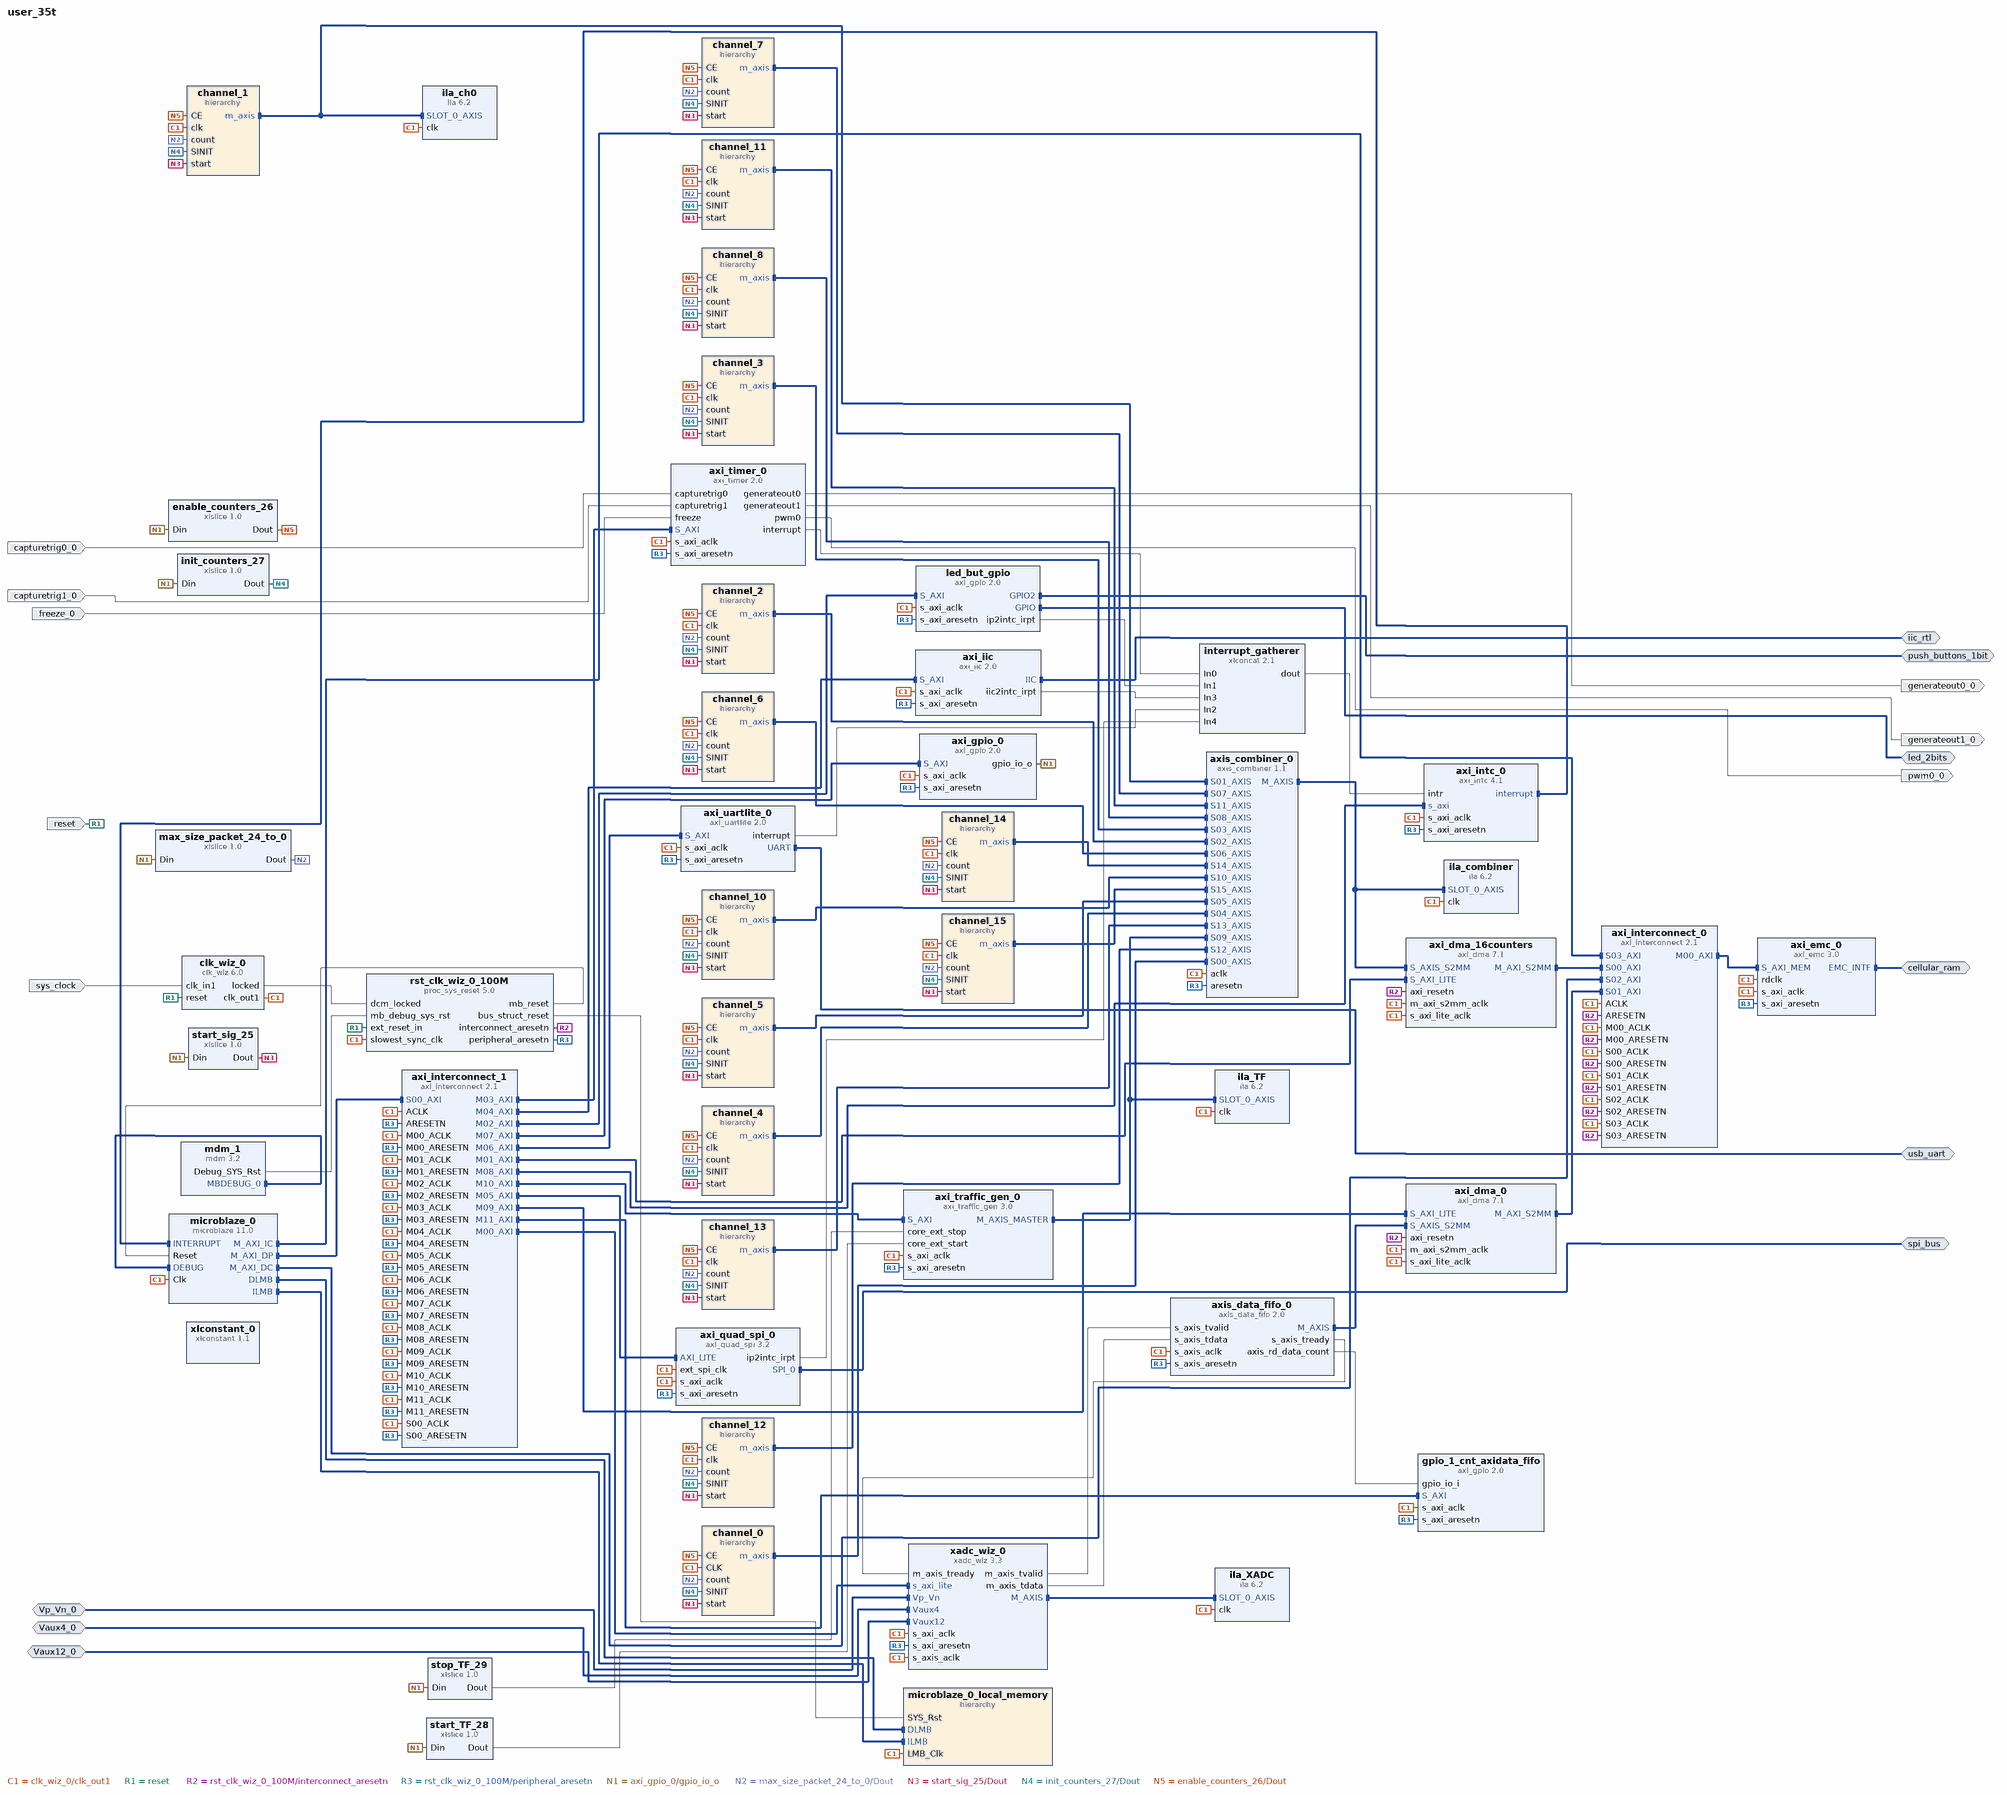
[diagram p0: block diagram of the top level]
# Vivado block design user_35t, xc7a35tcpg236-1, Vivado 2020.2
create_bd_design user_35t

create_bd_intf_port -mode Master -vlnv xilinx.com:interface:emc_rtl:1.0 cellular_ram
create_bd_intf_port -mode Master -vlnv xilinx.com:interface:gpio_rtl:1.0 led_2bits
create_bd_intf_port -mode Master -vlnv xilinx.com:interface:gpio_rtl:1.0 push_buttons_1bit
create_bd_intf_port -mode Master -vlnv xilinx.com:interface:uart_rtl:1.0 usb_uart
create_bd_intf_port -mode Master -vlnv xilinx.com:interface:iic_rtl:1.0 iic_rtl
create_bd_intf_port -mode Master -vlnv xilinx.com:interface:spi_rtl:1.0 spi_bus
create_bd_intf_port -mode Slave -vlnv xilinx.com:interface:diff_analog_io_rtl:1.0 Vp_Vn_0
create_bd_intf_port -mode Slave -vlnv xilinx.com:interface:diff_analog_io_rtl:1.0 Vaux4_0
create_bd_intf_port -mode Slave -vlnv xilinx.com:interface:diff_analog_io_rtl:1.0 Vaux12_0
create_bd_port -dir I -type rst reset
set_property -dict {CONFIG.POLARITY ACTIVE_HIGH} [get_bd_ports reset]
create_bd_port -dir I -type clk sys_clock
set_property -dict {CONFIG.FREQ_HZ 12000000 CONFIG.PHASE 0.000} [get_bd_ports sys_clock]
create_bd_port -dir O generateout0_0
create_bd_port -dir I capturetrig0_0
create_bd_port -dir I capturetrig1_0
create_bd_port -dir I freeze_0
create_bd_port -dir O generateout1_0
create_bd_port -dir O pwm0_0

create_bd_cell -type hier microblaze_0_local_memory
create_bd_cell -type ip -vlnv xilinx.com:ip:axi_emc:3.0 axi_emc_0
set_property -dict [list \
  CONFIG.C_MEM0_TYPE 1 \
  CONFIG.C_MEM0_WIDTH 8 \
  CONFIG.C_TAVDV_PS_MEM_0 8000 \
  CONFIG.C_TCEDV_PS_MEM_0 8000 \
  CONFIG.C_THZCE_PS_MEM_0 8000 \
  CONFIG.C_THZOE_PS_MEM_0 8000 \
  CONFIG.C_TLZWE_PS_MEM_0 3000 \
  CONFIG.C_TWC_PS_MEM_0 8000 \
  CONFIG.C_TWP_PS_MEM_0 8000 \
  CONFIG.EMC_BOARD_INTERFACE cellular_ram \
  CONFIG.USE_BOARD_FLOW true \
] [get_bd_cells axi_emc_0]
create_bd_cell -type ip -vlnv xilinx.com:ip:axi_gpio:2.0 led_but_gpio
set_property -dict [list \
  CONFIG.C_INTERRUPT_PRESENT 1 \
  CONFIG.GPIO2_BOARD_INTERFACE push_buttons_1bit \
  CONFIG.GPIO_BOARD_INTERFACE led_2bits \
  CONFIG.USE_BOARD_FLOW true \
] [get_bd_cells led_but_gpio]
create_bd_cell -type ip -vlnv xilinx.com:ip:axi_intc:4.1 axi_intc_0
set_property -dict [list \
  CONFIG.C_DISABLE_SYNCHRONIZERS 1 \
  CONFIG.C_HAS_FAST 0 \
  CONFIG.C_HAS_ILR 1 \
  CONFIG.C_MB_CLK_NOT_CONNECTED 1 \
] [get_bd_cells axi_intc_0]
create_bd_cell -type ip -vlnv xilinx.com:ip:axi_timer:2.0 axi_timer_0
create_bd_cell -type ip -vlnv xilinx.com:ip:axi_uartlite:2.0 axi_uartlite_0
set_property -dict {CONFIG.UARTLITE_BOARD_INTERFACE usb_uart CONFIG.USE_BOARD_FLOW true} [get_bd_cells axi_uartlite_0]
create_bd_cell -type ip -vlnv xilinx.com:ip:clk_wiz:6.0 clk_wiz_0
set_property -dict [list \
  CONFIG.CLKIN1_JITTER_PS 833.33 \
  CONFIG.CLKOUT1_JITTER 479.872 \
  CONFIG.CLKOUT1_PHASE_ERROR 668.310 \
  CONFIG.CLK_IN1_BOARD_INTERFACE sys_clock \
  CONFIG.MMCM_CLKFBOUT_MULT_F 62.500 \
  CONFIG.MMCM_CLKIN1_PERIOD 83.333 \
  CONFIG.MMCM_CLKIN2_PERIOD 10.0 \
  CONFIG.MMCM_CLKOUT0_DIVIDE_F 7.500 \
  CONFIG.RESET_BOARD_INTERFACE reset \
  CONFIG.USE_BOARD_FLOW true \
] [get_bd_cells clk_wiz_0]
create_bd_cell -type ip -vlnv xilinx.com:ip:mdm:3.2 mdm_1
create_bd_cell -type ip -vlnv xilinx.com:ip:microblaze:11.0 microblaze_0
set_property -dict [list \
  CONFIG.C_ADDR_TAG_BITS 8 \
  CONFIG.C_CACHE_BYTE_SIZE 2048 \
  CONFIG.C_DCACHE_ADDR_TAG 8 \
  CONFIG.C_DCACHE_BYTE_SIZE 2048 \
  CONFIG.C_DCACHE_USE_WRITEBACK 1 \
  CONFIG.C_DEBUG_ENABLED 1 \
  CONFIG.C_DIV_ZERO_EXCEPTION 1 \
  CONFIG.C_D_AXI 1 \
  CONFIG.C_D_LMB 1 \
  CONFIG.C_ICACHE_LINE_LEN 4 \
  CONFIG.C_ILL_OPCODE_EXCEPTION 1 \
  CONFIG.C_I_LMB 1 \
  CONFIG.C_M_AXI_D_BUS_EXCEPTION 1 \
  CONFIG.C_M_AXI_I_BUS_EXCEPTION 1 \
  CONFIG.C_NUMBER_OF_PC_BRK 2 \
  CONFIG.C_OPCODE_0x0_ILLEGAL 1 \
  CONFIG.C_UNALIGNED_EXCEPTIONS 1 \
  CONFIG.C_USE_BARREL 1 \
  CONFIG.C_USE_DCACHE 1 \
  CONFIG.C_USE_DIV 1 \
  CONFIG.C_USE_HW_MUL 1 \
  CONFIG.C_USE_ICACHE 1 \
  CONFIG.C_USE_MSR_INSTR 1 \
  CONFIG.C_USE_PCMP_INSTR 1 \
  CONFIG.C_USE_STACK_PROTECTION 1 \
  CONFIG.G_TEMPLATE_LIST 9 \
  CONFIG.G_USE_EXCEPTIONS 1 \
] [get_bd_cells microblaze_0]
create_bd_cell -type ip -vlnv xilinx.com:ip:proc_sys_reset:5.0 rst_clk_wiz_0_100M
set_property -dict {CONFIG.RESET_BOARD_INTERFACE reset CONFIG.USE_BOARD_FLOW true} [get_bd_cells rst_clk_wiz_0_100M]
create_bd_cell -type ip -vlnv xilinx.com:ip:xlconcat:2.1 interrupt_gatherer
set_property -dict {CONFIG.NUM_PORTS 5} [get_bd_cells interrupt_gatherer]
create_bd_cell -type ip -vlnv xilinx.com:ip:axi_iic:2.0 axi_iic
set_property -dict {CONFIG.IIC_FREQ_KHZ 400} [get_bd_cells axi_iic]
create_bd_cell -type ip -vlnv xilinx.com:ip:axi_quad_spi:3.2 axi_quad_spi_0
set_property -dict [list \
  CONFIG.C_FIFO_DEPTH 256 \
  CONFIG.C_SCK_RATIO 16 \
  CONFIG.C_SPI_MEMORY 1 \
  CONFIG.C_SPI_MODE 0 \
  CONFIG.QSPI_BOARD_INTERFACE Custom \
  CONFIG.USE_BOARD_FLOW true \
] [get_bd_cells axi_quad_spi_0]
create_bd_cell -type ip -vlnv xilinx.com:ip:xadc_wiz:3.3 xadc_wiz_0
set_property -dict [list \
  CONFIG.AVERAGE_ENABLE_TEMPERATURE false \
  CONFIG.AVERAGE_ENABLE_VAUXP0_VAUXN0 false \
  CONFIG.CHANNEL_ENABLE_TEMPERATURE true \
  CONFIG.CHANNEL_ENABLE_VAUXP0_VAUXN0 false \
  CONFIG.CHANNEL_ENABLE_VAUXP12_VAUXN12 true \
  CONFIG.CHANNEL_ENABLE_VAUXP4_VAUXN4 true \
  CONFIG.CHANNEL_ENABLE_VP_VN false \
  CONFIG.ENABLE_AXI4STREAM true \
  CONFIG.ENABLE_EXTERNAL_MUX false \
  CONFIG.EXTERNAL_MUXADDR_ENABLE true \
  CONFIG.EXTERNAL_MUX_CHANNEL VP_VN \
  CONFIG.OT_ALARM false \
  CONFIG.SEQUENCER_MODE Continuous \
  CONFIG.SINGLE_CHANNEL_SELECTION TEMPERATURE \
  CONFIG.VCCINT_ALARM false \
  CONFIG.XADC_STARUP_SELECTION channel_sequencer \
] [get_bd_cells xadc_wiz_0]
create_bd_cell -type ip -vlnv xilinx.com:ip:axi_dma:7.1 axi_dma_0
set_property -dict {CONFIG.c_include_mm2s 0 CONFIG.c_include_sg 0 CONFIG.c_micro_dma 0} [get_bd_cells axi_dma_0]
create_bd_cell -type ip -vlnv xilinx.com:ip:axi_gpio:2.0 axi_gpio_0
set_property -dict {CONFIG.C_ALL_OUTPUTS 1 CONFIG.C_GPIO_WIDTH 32} [get_bd_cells axi_gpio_0]
create_bd_cell -type ip -vlnv xilinx.com:ip:xlslice:1.0 max_size_packet_24_to_0
set_property -dict [list \
  CONFIG.DIN_FROM 24 \
  CONFIG.DIN_TO 0 \
  CONFIG.DIN_WIDTH 32 \
  CONFIG.DOUT_WIDTH 25 \
] [get_bd_cells max_size_packet_24_to_0]
create_bd_cell -type ip -vlnv xilinx.com:ip:xlslice:1.0 start_sig_25
set_property -dict {CONFIG.DIN_FROM 25 CONFIG.DIN_TO 25 CONFIG.DIN_WIDTH 32 CONFIG.DOUT_WIDTH 1} [get_bd_cells start_sig_25]
create_bd_cell -type ip -vlnv xilinx.com:ip:xlconstant:1.1 xlconstant_0
create_bd_cell -type ip -vlnv xilinx.com:ip:xlslice:1.0 init_counters_27
set_property -dict {CONFIG.DIN_FROM 27 CONFIG.DIN_TO 27 CONFIG.DIN_WIDTH 32 CONFIG.DOUT_WIDTH 1} [get_bd_cells init_counters_27]
create_bd_cell -type ip -vlnv xilinx.com:ip:axis_combiner:1.1 axis_combiner_0
set_property -dict {CONFIG.NUM_SI 16} [get_bd_cells axis_combiner_0]
create_bd_cell -type hier channel_0
create_bd_cell -type hier channel_1
create_bd_cell -type hier channel_2
create_bd_cell -type hier channel_3
create_bd_cell -type hier channel_5
create_bd_cell -type hier channel_6
create_bd_cell -type hier channel_7
create_bd_cell -type hier channel_8
create_bd_cell -type hier channel_10
create_bd_cell -type hier channel_11
create_bd_cell -type hier channel_12
create_bd_cell -type hier channel_13
create_bd_cell -type hier channel_14
create_bd_cell -type hier channel_15
create_bd_cell -type hier channel_4
create_bd_cell -type ip -vlnv xilinx.com:ip:axi_dma:7.1 axi_dma_16counters
set_property -dict {CONFIG.c_include_mm2s 0 CONFIG.c_include_sg 0 CONFIG.c_micro_dma 0} [get_bd_cells axi_dma_16counters]
create_bd_cell -type ip -vlnv xilinx.com:ip:ila:6.2 ila_combiner
set_property -dict {CONFIG.C_NUM_OF_PROBES 9 CONFIG.C_SLOT_0_AXI_PROTOCOL AXI4S} [get_bd_cells ila_combiner]
create_bd_cell -type ip -vlnv xilinx.com:ip:ila:6.2 ila_ch0
set_property -dict {CONFIG.C_NUM_OF_PROBES 9 CONFIG.C_SLOT_0_AXI_PROTOCOL AXI4S} [get_bd_cells ila_ch0]
create_bd_cell -type ip -vlnv xilinx.com:ip:xlslice:1.0 enable_counters_26
set_property -dict {CONFIG.DIN_FROM 26 CONFIG.DIN_TO 26 CONFIG.DIN_WIDTH 32 CONFIG.DOUT_WIDTH 1} [get_bd_cells enable_counters_26]
create_bd_cell -type ip -vlnv xilinx.com:ip:axi_interconnect:2.1 axi_interconnect_0
set_property -dict {CONFIG.NUM_MI 1 CONFIG.NUM_SI 4} [get_bd_cells axi_interconnect_0]
create_bd_cell -type ip -vlnv xilinx.com:ip:axi_interconnect:2.1 axi_interconnect_1
set_property -dict {CONFIG.NUM_MI 12} [get_bd_cells axi_interconnect_1]
create_bd_cell -type ip -vlnv xilinx.com:ip:axi_traffic_gen:3.0 axi_traffic_gen_0
set_property -dict [list \
  CONFIG.ATG_OPTIONS Custom \
  CONFIG.C_ATG_MODE AXI4-Stream \
  CONFIG.C_AXIS_MODE {Master Only} \
  CONFIG.C_AXIS_SPARSE_EN true \
  CONFIG.C_AXIS_TDATA_WIDTH 16 \
] [get_bd_cells axi_traffic_gen_0]
create_bd_cell -type ip -vlnv xilinx.com:ip:xlslice:1.0 start_TF_28
set_property -dict {CONFIG.DIN_FROM 28 CONFIG.DIN_TO 28 CONFIG.DIN_WIDTH 32 CONFIG.DOUT_WIDTH 1} [get_bd_cells start_TF_28]
create_bd_cell -type ip -vlnv xilinx.com:ip:xlslice:1.0 stop_TF_29
set_property -dict {CONFIG.DIN_FROM 29 CONFIG.DIN_TO 29 CONFIG.DIN_WIDTH 32 CONFIG.DOUT_WIDTH 1} [get_bd_cells stop_TF_29]
create_bd_cell -type ip -vlnv xilinx.com:ip:ila:6.2 ila_TF
set_property -dict {CONFIG.C_NUM_OF_PROBES 9 CONFIG.C_SLOT_0_AXI_PROTOCOL AXI4S} [get_bd_cells ila_TF]
create_bd_cell -type ip -vlnv xilinx.com:ip:ila:6.2 ila_XADC
set_property -dict {CONFIG.C_NUM_OF_PROBES 9 CONFIG.C_SLOT_0_AXI_PROTOCOL AXI4S} [get_bd_cells ila_XADC]
create_bd_cell -type ip -vlnv xilinx.com:ip:axis_data_fifo:2.0 axis_data_fifo_0
set_property -dict [list \
  CONFIG.FIFO_DEPTH 4096 \
  CONFIG.HAS_RD_DATA_COUNT 1 \
  CONFIG.HAS_TLAST 1 \
  CONFIG.TDATA_NUM_BYTES 2 \
] [get_bd_cells axis_data_fifo_0]
create_bd_cell -type ip -vlnv xilinx.com:ip:axi_gpio:2.0 gpio_1_cnt_axidata_fifo
set_property -dict {CONFIG.C_ALL_INPUTS 1} [get_bd_cells gpio_1_cnt_axidata_fifo]

# ---- hierarchy /microblaze_0_local_memory ----
current_bd_instance /microblaze_0_local_memory
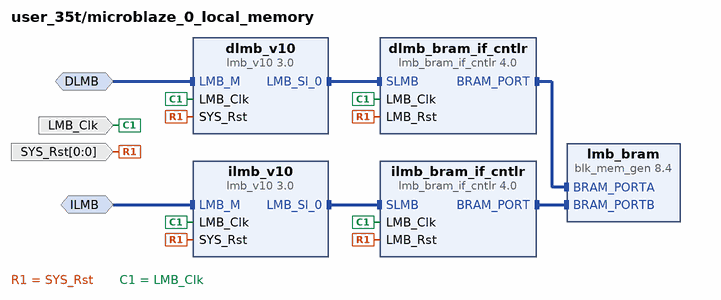
[diagram p1: block diagram inside /microblaze_0_local_memory]
create_bd_intf_pin -mode MirroredMaster -vlnv xilinx.com:interface:lmb_rtl:1.0 DLMB
create_bd_intf_pin -mode MirroredMaster -vlnv xilinx.com:interface:lmb_rtl:1.0 ILMB
create_bd_pin -dir I -type clk LMB_Clk
create_bd_pin -dir I -from 0 -to 0 -type rst SYS_Rst

create_bd_cell -type ip -vlnv xilinx.com:ip:lmb_bram_if_cntlr:4.0 dlmb_bram_if_cntlr
set_property -dict {CONFIG.C_ECC 0} [get_bd_cells dlmb_bram_if_cntlr]
create_bd_cell -type ip -vlnv xilinx.com:ip:lmb_v10:3.0 dlmb_v10
create_bd_cell -type ip -vlnv xilinx.com:ip:lmb_bram_if_cntlr:4.0 ilmb_bram_if_cntlr
set_property -dict {CONFIG.C_ECC 0} [get_bd_cells ilmb_bram_if_cntlr]
create_bd_cell -type ip -vlnv xilinx.com:ip:lmb_v10:3.0 ilmb_v10
create_bd_cell -type ip -vlnv xilinx.com:ip:blk_mem_gen:8.4 lmb_bram
set_property -dict [list \
  CONFIG.EN_SAFETY_CKT false \
  CONFIG.Enable_B Use_ENB_Pin \
  CONFIG.Memory_Type True_Dual_Port_RAM \
  CONFIG.Port_B_Clock 100 \
  CONFIG.Port_B_Enable_Rate 100 \
  CONFIG.Port_B_Write_Rate 50 \
  CONFIG.Use_RSTB_Pin true \
  CONFIG.use_bram_block BRAM_Controller \
] [get_bd_cells lmb_bram]

# ---- hierarchy /channel_0 ----
current_bd_instance /channel_0
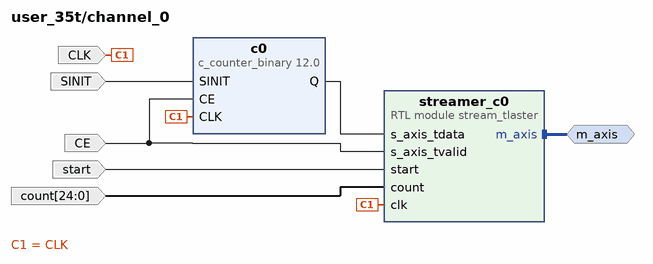
[diagram p2: block diagram inside /channel_0]
create_bd_intf_pin -mode Master -vlnv xilinx.com:interface:axis_rtl:1.0 m_axis
create_bd_pin -dir I start
create_bd_pin -dir I -from 24 -to 0 count
create_bd_pin -dir I -type data SINIT
create_bd_pin -dir I -type clk CLK
create_bd_pin -dir I CE

create_bd_cell -type ip -vlnv xilinx.com:ip:c_counter_binary:12.0 c0
set_property -dict [list \
  CONFIG.CE true \
  CONFIG.Load false \
  CONFIG.Output_Width 16 \
  CONFIG.SCLR false \
  CONFIG.SINIT true \
  CONFIG.SINIT_Value 0 \
  CONFIG.Sync_Threshold_Output false \
] [get_bd_cells c0]
create_bd_cell -type module -reference stream_tlaster streamer_c0

# ---- hierarchy /channel_1 ----
current_bd_instance /channel_1
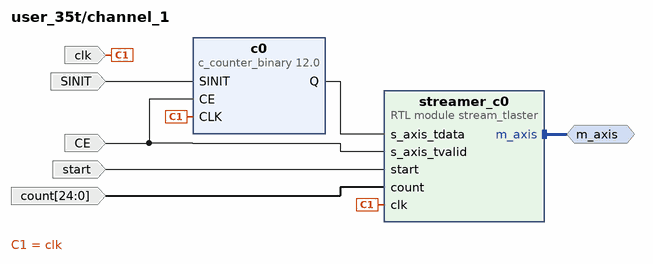
[diagram p3: block diagram inside /channel_1]
create_bd_intf_pin -mode Master -vlnv xilinx.com:interface:axis_rtl:1.0 m_axis
create_bd_pin -dir I start
create_bd_pin -dir I -from 24 -to 0 count
create_bd_pin -dir I -type data SINIT
create_bd_pin -dir I clk
create_bd_pin -dir I CE

create_bd_cell -type ip -vlnv xilinx.com:ip:c_counter_binary:12.0 c0
set_property -dict [list \
  CONFIG.CE true \
  CONFIG.Load false \
  CONFIG.Output_Width 16 \
  CONFIG.SCLR false \
  CONFIG.SINIT true \
  CONFIG.SINIT_Value 1000 \
  CONFIG.SSET false \
  CONFIG.Sync_Threshold_Output false \
] [get_bd_cells c0]
create_bd_cell -type module -reference stream_tlaster streamer_c0

# ---- hierarchy /channel_2 ----
current_bd_instance /channel_2
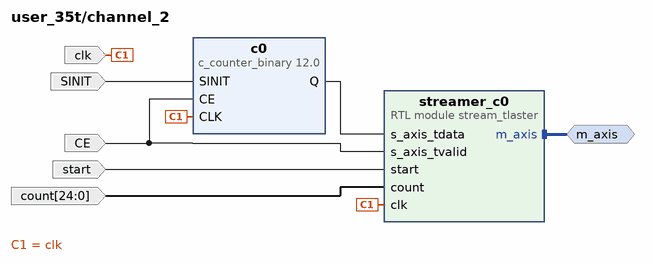
[diagram p4: block diagram inside /channel_2]
create_bd_intf_pin -mode Master -vlnv xilinx.com:interface:axis_rtl:1.0 m_axis
create_bd_pin -dir I start
create_bd_pin -dir I -from 24 -to 0 count
create_bd_pin -dir I -type data SINIT
create_bd_pin -dir I clk
create_bd_pin -dir I -type ce CE

create_bd_cell -type ip -vlnv xilinx.com:ip:c_counter_binary:12.0 c0
set_property -dict [list \
  CONFIG.CE true \
  CONFIG.Load false \
  CONFIG.Output_Width 16 \
  CONFIG.SCLR false \
  CONFIG.SINIT true \
  CONFIG.SINIT_Value 2000 \
  CONFIG.Sync_Threshold_Output false \
] [get_bd_cells c0]
create_bd_cell -type module -reference stream_tlaster streamer_c0

# ---- hierarchy /channel_3 ----
current_bd_instance /channel_3
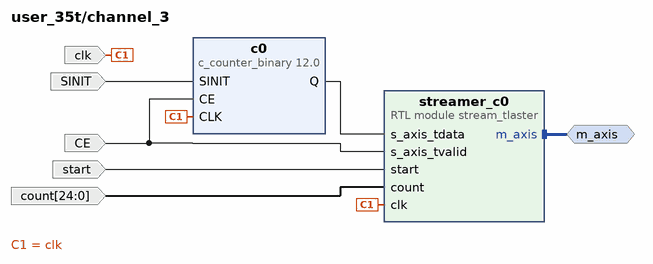
[diagram p5: block diagram inside /channel_3]
create_bd_intf_pin -mode Master -vlnv xilinx.com:interface:axis_rtl:1.0 m_axis
create_bd_pin -dir I start
create_bd_pin -dir I -from 24 -to 0 count
create_bd_pin -dir I -type data SINIT
create_bd_pin -dir I clk
create_bd_pin -dir I CE

create_bd_cell -type ip -vlnv xilinx.com:ip:c_counter_binary:12.0 c0
set_property -dict [list \
  CONFIG.CE true \
  CONFIG.Load false \
  CONFIG.Output_Width 16 \
  CONFIG.SCLR false \
  CONFIG.SINIT true \
  CONFIG.SINIT_Value 3000 \
  CONFIG.Sync_Threshold_Output false \
] [get_bd_cells c0]
create_bd_cell -type module -reference stream_tlaster streamer_c0

# ---- hierarchy /channel_5 ----
current_bd_instance /channel_5
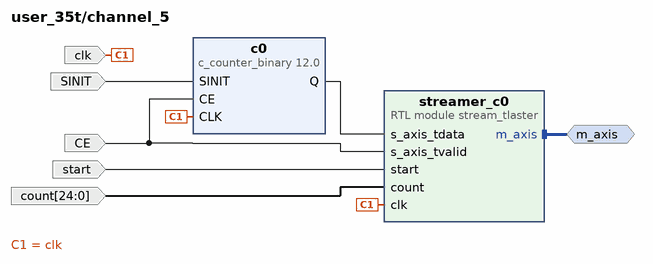
[diagram p6: block diagram inside /channel_5]
create_bd_intf_pin -mode Master -vlnv xilinx.com:interface:axis_rtl:1.0 m_axis
create_bd_pin -dir I start
create_bd_pin -dir I -from 24 -to 0 count
create_bd_pin -dir I -type data SINIT
create_bd_pin -dir I clk
create_bd_pin -dir I CE

create_bd_cell -type ip -vlnv xilinx.com:ip:c_counter_binary:12.0 c0
set_property -dict [list \
  CONFIG.CE true \
  CONFIG.Load false \
  CONFIG.Output_Width 16 \
  CONFIG.SCLR false \
  CONFIG.SINIT true \
  CONFIG.SINIT_Value 5000 \
  CONFIG.Sync_Threshold_Output false \
] [get_bd_cells c0]
create_bd_cell -type module -reference stream_tlaster streamer_c0

# ---- hierarchy /channel_6 ----
current_bd_instance /channel_6
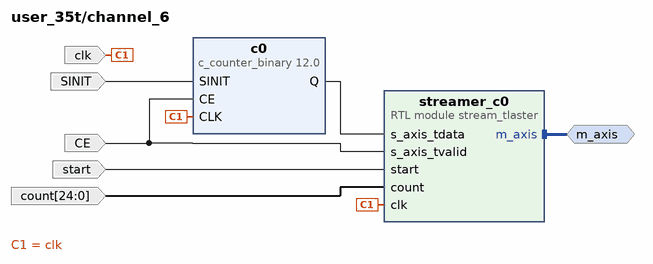
[diagram p7: block diagram inside /channel_6]
create_bd_intf_pin -mode Master -vlnv xilinx.com:interface:axis_rtl:1.0 m_axis
create_bd_pin -dir I start
create_bd_pin -dir I -from 24 -to 0 count
create_bd_pin -dir I -type data SINIT
create_bd_pin -dir I clk
create_bd_pin -dir I CE

create_bd_cell -type ip -vlnv xilinx.com:ip:c_counter_binary:12.0 c0
set_property -dict [list \
  CONFIG.CE true \
  CONFIG.Load false \
  CONFIG.Output_Width 16 \
  CONFIG.SCLR false \
  CONFIG.SINIT true \
  CONFIG.SINIT_Value 6000 \
  CONFIG.Sync_Threshold_Output false \
] [get_bd_cells c0]
create_bd_cell -type module -reference stream_tlaster streamer_c0

# ---- hierarchy /channel_7 ----
current_bd_instance /channel_7
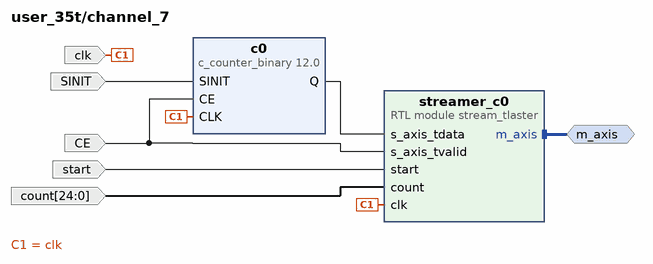
[diagram p8: block diagram inside /channel_7]
create_bd_intf_pin -mode Master -vlnv xilinx.com:interface:axis_rtl:1.0 m_axis
create_bd_pin -dir I start
create_bd_pin -dir I -from 24 -to 0 count
create_bd_pin -dir I -type data SINIT
create_bd_pin -dir I clk
create_bd_pin -dir I CE

create_bd_cell -type ip -vlnv xilinx.com:ip:c_counter_binary:12.0 c0
set_property -dict [list \
  CONFIG.CE true \
  CONFIG.Load false \
  CONFIG.Output_Width 16 \
  CONFIG.SCLR false \
  CONFIG.SINIT true \
  CONFIG.SINIT_Value 7000 \
  CONFIG.Sync_Threshold_Output false \
] [get_bd_cells c0]
create_bd_cell -type module -reference stream_tlaster streamer_c0

# ---- hierarchy /channel_8 ----
current_bd_instance /channel_8
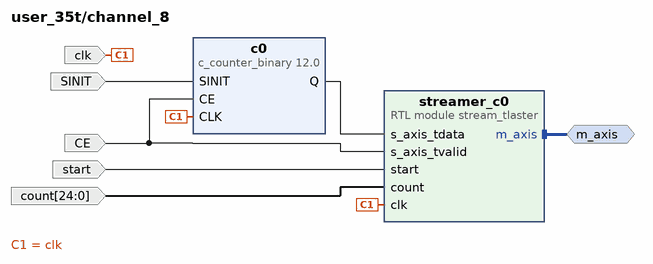
[diagram p9: block diagram inside /channel_8]
create_bd_intf_pin -mode Master -vlnv xilinx.com:interface:axis_rtl:1.0 m_axis
create_bd_pin -dir I start
create_bd_pin -dir I -from 24 -to 0 count
create_bd_pin -dir I -type data SINIT
create_bd_pin -dir I clk
create_bd_pin -dir I CE

create_bd_cell -type ip -vlnv xilinx.com:ip:c_counter_binary:12.0 c0
set_property -dict [list \
  CONFIG.CE true \
  CONFIG.Load false \
  CONFIG.Output_Width 16 \
  CONFIG.SCLR false \
  CONFIG.SINIT true \
  CONFIG.SINIT_Value 8000 \
  CONFIG.Sync_Threshold_Output false \
] [get_bd_cells c0]
create_bd_cell -type module -reference stream_tlaster streamer_c0

# ---- hierarchy /channel_10 ----
current_bd_instance /channel_10
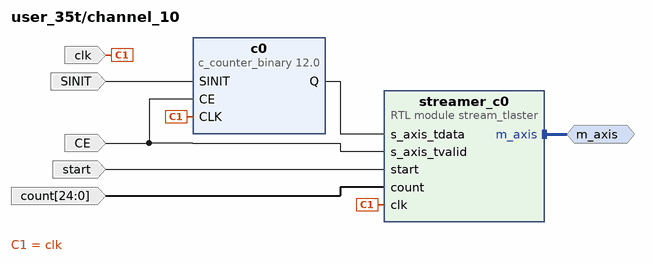
[diagram p10: block diagram inside /channel_10]
create_bd_intf_pin -mode Master -vlnv xilinx.com:interface:axis_rtl:1.0 m_axis
create_bd_pin -dir I start
create_bd_pin -dir I -from 24 -to 0 count
create_bd_pin -dir I -type data SINIT
create_bd_pin -dir I clk
create_bd_pin -dir I CE

create_bd_cell -type ip -vlnv xilinx.com:ip:c_counter_binary:12.0 c0
set_property -dict [list \
  CONFIG.CE true \
  CONFIG.Load false \
  CONFIG.Output_Width 16 \
  CONFIG.SCLR false \
  CONFIG.SINIT true \
  CONFIG.SINIT_Value a000 \
  CONFIG.Sync_Threshold_Output false \
] [get_bd_cells c0]
create_bd_cell -type module -reference stream_tlaster streamer_c0

# ---- hierarchy /channel_11 ----
current_bd_instance /channel_11
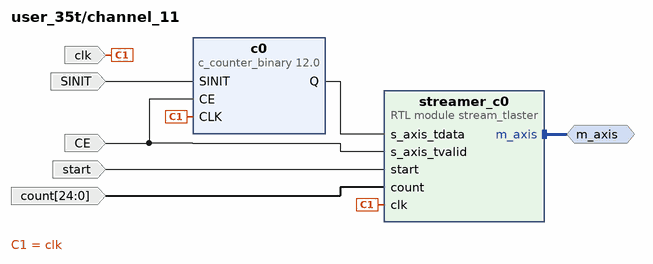
[diagram p11: block diagram inside /channel_11]
create_bd_intf_pin -mode Master -vlnv xilinx.com:interface:axis_rtl:1.0 m_axis
create_bd_pin -dir I start
create_bd_pin -dir I -from 24 -to 0 count
create_bd_pin -dir I -type data SINIT
create_bd_pin -dir I clk
create_bd_pin -dir I CE

create_bd_cell -type ip -vlnv xilinx.com:ip:c_counter_binary:12.0 c0
set_property -dict [list \
  CONFIG.CE true \
  CONFIG.Load false \
  CONFIG.Output_Width 16 \
  CONFIG.SCLR false \
  CONFIG.SINIT true \
  CONFIG.SINIT_Value B000 \
  CONFIG.Sync_Threshold_Output false \
] [get_bd_cells c0]
create_bd_cell -type module -reference stream_tlaster streamer_c0

# ---- hierarchy /channel_12 ----
current_bd_instance /channel_12
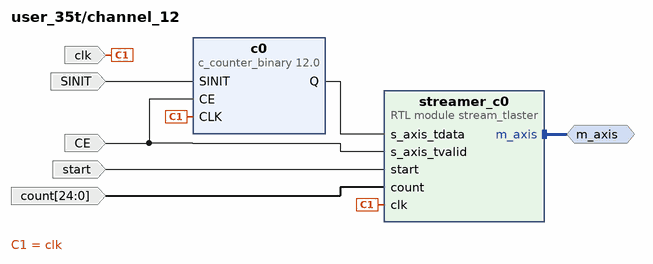
[diagram p12: block diagram inside /channel_12]
create_bd_intf_pin -mode Master -vlnv xilinx.com:interface:axis_rtl:1.0 m_axis
create_bd_pin -dir I start
create_bd_pin -dir I -from 24 -to 0 count
create_bd_pin -dir I -type data SINIT
create_bd_pin -dir I clk
create_bd_pin -dir I CE

create_bd_cell -type ip -vlnv xilinx.com:ip:c_counter_binary:12.0 c0
set_property -dict [list \
  CONFIG.CE true \
  CONFIG.Load false \
  CONFIG.Output_Width 16 \
  CONFIG.SCLR false \
  CONFIG.SINIT true \
  CONFIG.SINIT_Value C000 \
  CONFIG.Sync_Threshold_Output false \
] [get_bd_cells c0]
create_bd_cell -type module -reference stream_tlaster streamer_c0

# ---- hierarchy /channel_13 ----
current_bd_instance /channel_13
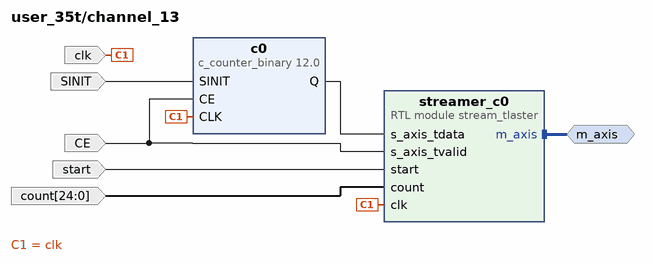
[diagram p13: block diagram inside /channel_13]
create_bd_intf_pin -mode Master -vlnv xilinx.com:interface:axis_rtl:1.0 m_axis
create_bd_pin -dir I start
create_bd_pin -dir I -from 24 -to 0 count
create_bd_pin -dir I -type data SINIT
create_bd_pin -dir I clk
create_bd_pin -dir I CE

create_bd_cell -type ip -vlnv xilinx.com:ip:c_counter_binary:12.0 c0
set_property -dict [list \
  CONFIG.CE true \
  CONFIG.Load false \
  CONFIG.Output_Width 16 \
  CONFIG.SCLR false \
  CONFIG.SINIT true \
  CONFIG.SINIT_Value D000 \
  CONFIG.Sync_Threshold_Output false \
] [get_bd_cells c0]
create_bd_cell -type module -reference stream_tlaster streamer_c0

# ---- hierarchy /channel_14 ----
current_bd_instance /channel_14
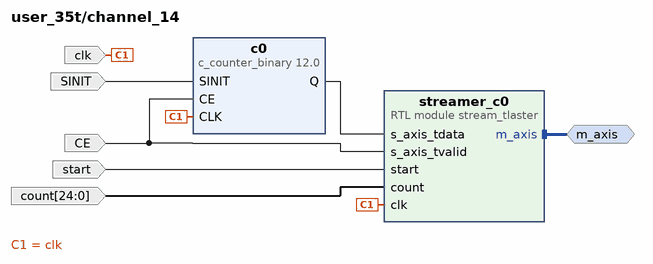
[diagram p14: block diagram inside /channel_14]
create_bd_intf_pin -mode Master -vlnv xilinx.com:interface:axis_rtl:1.0 m_axis
create_bd_pin -dir I start
create_bd_pin -dir I -from 24 -to 0 count
create_bd_pin -dir I -type data SINIT
create_bd_pin -dir I clk
create_bd_pin -dir I CE

create_bd_cell -type ip -vlnv xilinx.com:ip:c_counter_binary:12.0 c0
set_property -dict [list \
  CONFIG.CE true \
  CONFIG.Load false \
  CONFIG.Output_Width 16 \
  CONFIG.SCLR false \
  CONFIG.SINIT true \
  CONFIG.SINIT_Value E000 \
  CONFIG.Sync_Threshold_Output false \
] [get_bd_cells c0]
create_bd_cell -type module -reference stream_tlaster streamer_c0

# ---- hierarchy /channel_15 ----
current_bd_instance /channel_15
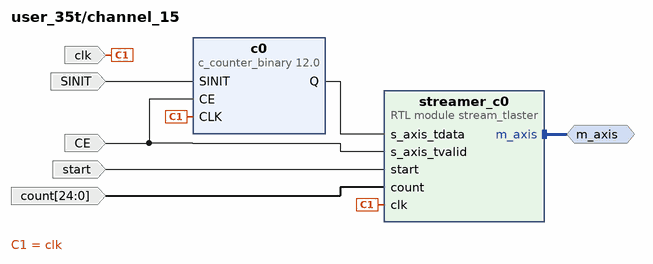
[diagram p15: block diagram inside /channel_15]
create_bd_intf_pin -mode Master -vlnv xilinx.com:interface:axis_rtl:1.0 m_axis
create_bd_pin -dir I start
create_bd_pin -dir I -from 24 -to 0 count
create_bd_pin -dir I -type data SINIT
create_bd_pin -dir I clk
create_bd_pin -dir I CE

create_bd_cell -type ip -vlnv xilinx.com:ip:c_counter_binary:12.0 c0
set_property -dict [list \
  CONFIG.CE true \
  CONFIG.Load false \
  CONFIG.Output_Width 16 \
  CONFIG.SCLR false \
  CONFIG.SINIT true \
  CONFIG.SINIT_Value F000 \
  CONFIG.Sync_Threshold_Output false \
] [get_bd_cells c0]
create_bd_cell -type module -reference stream_tlaster streamer_c0

# ---- hierarchy /channel_4 ----
current_bd_instance /channel_4
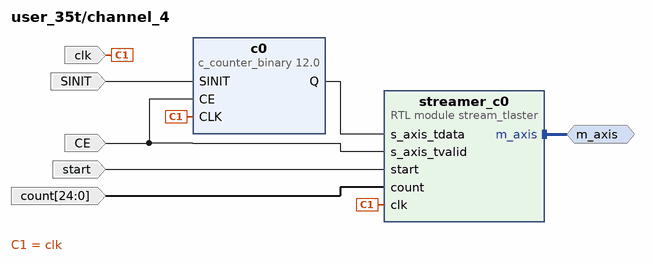
[diagram p16: block diagram inside /channel_4]
create_bd_intf_pin -mode Master -vlnv xilinx.com:interface:axis_rtl:1.0 m_axis
create_bd_pin -dir I start
create_bd_pin -dir I -from 24 -to 0 count
create_bd_pin -dir I -type data SINIT
create_bd_pin -dir I clk
create_bd_pin -dir I CE

create_bd_cell -type ip -vlnv xilinx.com:ip:c_counter_binary:12.0 c0
set_property -dict [list \
  CONFIG.CE true \
  CONFIG.Load false \
  CONFIG.Output_Width 16 \
  CONFIG.SCLR false \
  CONFIG.SINIT true \
  CONFIG.SINIT_Value 4000 \
  CONFIG.Sync_Threshold_Output false \
] [get_bd_cells c0]
create_bd_cell -type module -reference stream_tlaster streamer_c0

# ---- connections ----

current_bd_instance /microblaze_0_local_memory
connect_bd_intf_net -intf_net microblaze_0_dlmb [get_bd_intf_pins DLMB] [get_bd_intf_pins dlmb_v10/LMB_M]
connect_bd_intf_net -intf_net microblaze_0_ilmb_cntlr [get_bd_intf_pins ilmb_bram_if_cntlr/BRAM_PORT] [get_bd_intf_pins lmb_bram/BRAM_PORTB]
connect_bd_intf_net -intf_net microblaze_0_dlmb_bus [get_bd_intf_pins dlmb_bram_if_cntlr/SLMB] [get_bd_intf_pins dlmb_v10/LMB_Sl_0]
connect_bd_intf_net -intf_net microblaze_0_ilmb [get_bd_intf_pins ILMB] [get_bd_intf_pins ilmb_v10/LMB_M]
connect_bd_intf_net -intf_net microblaze_0_dlmb_cntlr [get_bd_intf_pins dlmb_bram_if_cntlr/BRAM_PORT] [get_bd_intf_pins lmb_bram/BRAM_PORTA]
connect_bd_intf_net -intf_net microblaze_0_ilmb_bus [get_bd_intf_pins ilmb_bram_if_cntlr/SLMB] [get_bd_intf_pins ilmb_v10/LMB_Sl_0]
connect_bd_net [get_bd_pins SYS_Rst] \
  [get_bd_pins dlmb_bram_if_cntlr/LMB_Rst] [get_bd_pins dlmb_v10/SYS_Rst] [get_bd_pins ilmb_bram_if_cntlr/LMB_Rst] \
  [get_bd_pins ilmb_v10/SYS_Rst]
connect_bd_net -net microblaze_0_Clk [get_bd_pins LMB_Clk] \
  [get_bd_pins dlmb_bram_if_cntlr/LMB_Clk] [get_bd_pins dlmb_v10/LMB_Clk] [get_bd_pins ilmb_bram_if_cntlr/LMB_Clk] \
  [get_bd_pins ilmb_v10/LMB_Clk]
set_property HDL_ATTRIBUTE.BMM_INFO_ADDRESS_SPACE {byte  0x00000000 32 > user_35t microblaze_0_local_memory/lmb_bram} [get_bd_cells dlmb_bram_if_cntlr]
set_property HDL_ATTRIBUTE.KEEP_HIERARCHY yes [get_bd_cells dlmb_bram_if_cntlr]

current_bd_instance /channel_0
connect_bd_intf_net [get_bd_intf_pins m_axis] [get_bd_intf_pins streamer_c0/m_axis]
connect_bd_net -net c_counter_binary_1_Q [get_bd_pins c0/Q] [get_bd_pins streamer_c0/s_axis_tdata]
connect_bd_net -net start_0_1 [get_bd_pins start] [get_bd_pins streamer_c0/start]
connect_bd_net -net count_0_1 [get_bd_pins count] [get_bd_pins streamer_c0/count]
connect_bd_net -net SINIT_1_1 [get_bd_pins SINIT] [get_bd_pins c0/SINIT]
connect_bd_net -net CLK_0_1 [get_bd_pins CLK] [get_bd_pins c0/CLK] [get_bd_pins streamer_c0/clk]
connect_bd_net [get_bd_pins CE] [get_bd_pins c0/CE] [get_bd_pins streamer_c0/s_axis_tvalid]

current_bd_instance /channel_1
connect_bd_intf_net [get_bd_intf_pins m_axis] [get_bd_intf_pins streamer_c0/m_axis]
connect_bd_net [get_bd_pins clk] [get_bd_pins c0/CLK] [get_bd_pins streamer_c0/clk]
connect_bd_net -net c_counter_binary_1_Q [get_bd_pins c0/Q] [get_bd_pins streamer_c0/s_axis_tdata]
connect_bd_net -net start_0_1 [get_bd_pins start] [get_bd_pins streamer_c0/start]
connect_bd_net -net count_0_1 [get_bd_pins count] [get_bd_pins streamer_c0/count]
connect_bd_net -net SINIT_0_1 [get_bd_pins SINIT] [get_bd_pins c0/SINIT]
connect_bd_net [get_bd_pins CE] [get_bd_pins c0/CE] [get_bd_pins streamer_c0/s_axis_tvalid]

current_bd_instance /channel_2
connect_bd_intf_net [get_bd_intf_pins m_axis] [get_bd_intf_pins streamer_c0/m_axis]
connect_bd_net [get_bd_pins clk] [get_bd_pins c0/CLK] [get_bd_pins streamer_c0/clk]
connect_bd_net -net c_counter_binary_1_Q [get_bd_pins c0/Q] [get_bd_pins streamer_c0/s_axis_tdata]
connect_bd_net -net start_0_1 [get_bd_pins start] [get_bd_pins streamer_c0/start]
connect_bd_net -net count_0_1 [get_bd_pins count] [get_bd_pins streamer_c0/count]
connect_bd_net -net SINIT_0_1 [get_bd_pins SINIT] [get_bd_pins c0/SINIT]
connect_bd_net -net CE_0_1 [get_bd_pins CE] [get_bd_pins c0/CE] [get_bd_pins streamer_c0/s_axis_tvalid]

current_bd_instance /channel_3
connect_bd_intf_net [get_bd_intf_pins m_axis] [get_bd_intf_pins streamer_c0/m_axis]
connect_bd_net [get_bd_pins clk] [get_bd_pins c0/CLK] [get_bd_pins streamer_c0/clk]
connect_bd_net -net c_counter_binary_1_Q [get_bd_pins c0/Q] [get_bd_pins streamer_c0/s_axis_tdata]
connect_bd_net -net start_0_1 [get_bd_pins start] [get_bd_pins streamer_c0/start]
connect_bd_net -net count_0_1 [get_bd_pins count] [get_bd_pins streamer_c0/count]
connect_bd_net -net SINIT_0_1 [get_bd_pins SINIT] [get_bd_pins c0/SINIT]
connect_bd_net [get_bd_pins CE] [get_bd_pins c0/CE] [get_bd_pins streamer_c0/s_axis_tvalid]

current_bd_instance /channel_5
connect_bd_intf_net [get_bd_intf_pins m_axis] [get_bd_intf_pins streamer_c0/m_axis]
connect_bd_net [get_bd_pins clk] [get_bd_pins c0/CLK] [get_bd_pins streamer_c0/clk]
connect_bd_net -net c_counter_binary_1_Q [get_bd_pins c0/Q] [get_bd_pins streamer_c0/s_axis_tdata]
connect_bd_net -net start_0_1 [get_bd_pins start] [get_bd_pins streamer_c0/start]
connect_bd_net -net count_0_1 [get_bd_pins count] [get_bd_pins streamer_c0/count]
connect_bd_net -net SINIT_0_1 [get_bd_pins SINIT] [get_bd_pins c0/SINIT]
connect_bd_net [get_bd_pins CE] [get_bd_pins c0/CE] [get_bd_pins streamer_c0/s_axis_tvalid]

current_bd_instance /channel_6
connect_bd_intf_net [get_bd_intf_pins m_axis] [get_bd_intf_pins streamer_c0/m_axis]
connect_bd_net [get_bd_pins clk] [get_bd_pins c0/CLK] [get_bd_pins streamer_c0/clk]
connect_bd_net -net c_counter_binary_1_Q [get_bd_pins c0/Q] [get_bd_pins streamer_c0/s_axis_tdata]
connect_bd_net -net start_0_1 [get_bd_pins start] [get_bd_pins streamer_c0/start]
connect_bd_net -net count_0_1 [get_bd_pins count] [get_bd_pins streamer_c0/count]
connect_bd_net -net SINIT_1_1 [get_bd_pins SINIT] [get_bd_pins c0/SINIT]
connect_bd_net [get_bd_pins CE] [get_bd_pins c0/CE] [get_bd_pins streamer_c0/s_axis_tvalid]

current_bd_instance /channel_7
connect_bd_intf_net [get_bd_intf_pins m_axis] [get_bd_intf_pins streamer_c0/m_axis]
connect_bd_net [get_bd_pins clk] [get_bd_pins c0/CLK] [get_bd_pins streamer_c0/clk]
connect_bd_net -net c_counter_binary_1_Q [get_bd_pins c0/Q] [get_bd_pins streamer_c0/s_axis_tdata]
connect_bd_net -net start_0_1 [get_bd_pins start] [get_bd_pins streamer_c0/start]
connect_bd_net -net count_0_1 [get_bd_pins count] [get_bd_pins streamer_c0/count]
connect_bd_net -net SINIT_2_1 [get_bd_pins SINIT] [get_bd_pins c0/SINIT]
connect_bd_net [get_bd_pins CE] [get_bd_pins c0/CE] [get_bd_pins streamer_c0/s_axis_tvalid]

current_bd_instance /channel_8
connect_bd_intf_net [get_bd_intf_pins m_axis] [get_bd_intf_pins streamer_c0/m_axis]
connect_bd_net [get_bd_pins clk] [get_bd_pins c0/CLK] [get_bd_pins streamer_c0/clk]
connect_bd_net -net c_counter_binary_1_Q [get_bd_pins c0/Q] [get_bd_pins streamer_c0/s_axis_tdata]
connect_bd_net -net start_0_1 [get_bd_pins start] [get_bd_pins streamer_c0/start]
connect_bd_net -net count_0_1 [get_bd_pins count] [get_bd_pins streamer_c0/count]
connect_bd_net -net SINIT_0_1 [get_bd_pins SINIT] [get_bd_pins c0/SINIT]
connect_bd_net [get_bd_pins CE] [get_bd_pins c0/CE] [get_bd_pins streamer_c0/s_axis_tvalid]

current_bd_instance /channel_10
connect_bd_intf_net [get_bd_intf_pins m_axis] [get_bd_intf_pins streamer_c0/m_axis]
connect_bd_net [get_bd_pins clk] [get_bd_pins c0/CLK] [get_bd_pins streamer_c0/clk]
connect_bd_net -net c_counter_binary_1_Q [get_bd_pins c0/Q] [get_bd_pins streamer_c0/s_axis_tdata]
connect_bd_net -net start_0_1 [get_bd_pins start] [get_bd_pins streamer_c0/start]
connect_bd_net -net count_0_1 [get_bd_pins count] [get_bd_pins streamer_c0/count]
connect_bd_net -net SINIT_1_1 [get_bd_pins SINIT] [get_bd_pins c0/SINIT]
connect_bd_net [get_bd_pins CE] [get_bd_pins c0/CE] [get_bd_pins streamer_c0/s_axis_tvalid]

current_bd_instance /channel_11
connect_bd_intf_net [get_bd_intf_pins m_axis] [get_bd_intf_pins streamer_c0/m_axis]
connect_bd_net [get_bd_pins clk] [get_bd_pins c0/CLK] [get_bd_pins streamer_c0/clk]
connect_bd_net -net c_counter_binary_1_Q [get_bd_pins c0/Q] [get_bd_pins streamer_c0/s_axis_tdata]
connect_bd_net -net start_0_1 [get_bd_pins start] [get_bd_pins streamer_c0/start]
connect_bd_net -net count_0_1 [get_bd_pins count] [get_bd_pins streamer_c0/count]
connect_bd_net -net SINIT_2_1 [get_bd_pins SINIT] [get_bd_pins c0/SINIT]
connect_bd_net [get_bd_pins CE] [get_bd_pins c0/CE] [get_bd_pins streamer_c0/s_axis_tvalid]

current_bd_instance /channel_12
connect_bd_intf_net [get_bd_intf_pins m_axis] [get_bd_intf_pins streamer_c0/m_axis]
connect_bd_net [get_bd_pins clk] [get_bd_pins c0/CLK] [get_bd_pins streamer_c0/clk]
connect_bd_net -net c_counter_binary_1_Q [get_bd_pins c0/Q] [get_bd_pins streamer_c0/s_axis_tdata]
connect_bd_net -net start_0_1 [get_bd_pins start] [get_bd_pins streamer_c0/start]
connect_bd_net -net count_0_1 [get_bd_pins count] [get_bd_pins streamer_c0/count]
connect_bd_net -net SINIT_3_1 [get_bd_pins SINIT] [get_bd_pins c0/SINIT]
connect_bd_net [get_bd_pins CE] [get_bd_pins c0/CE] [get_bd_pins streamer_c0/s_axis_tvalid]

current_bd_instance /channel_13
connect_bd_intf_net [get_bd_intf_pins m_axis] [get_bd_intf_pins streamer_c0/m_axis]
connect_bd_net [get_bd_pins clk] [get_bd_pins c0/CLK] [get_bd_pins streamer_c0/clk]
connect_bd_net -net c_counter_binary_1_Q [get_bd_pins c0/Q] [get_bd_pins streamer_c0/s_axis_tdata]
connect_bd_net -net start_0_1 [get_bd_pins start] [get_bd_pins streamer_c0/start]
connect_bd_net -net count_0_1 [get_bd_pins count] [get_bd_pins streamer_c0/count]
connect_bd_net -net SINIT_4_1 [get_bd_pins SINIT] [get_bd_pins c0/SINIT]
connect_bd_net [get_bd_pins CE] [get_bd_pins c0/CE] [get_bd_pins streamer_c0/s_axis_tvalid]

current_bd_instance /channel_14
connect_bd_intf_net [get_bd_intf_pins m_axis] [get_bd_intf_pins streamer_c0/m_axis]
connect_bd_net [get_bd_pins clk] [get_bd_pins c0/CLK] [get_bd_pins streamer_c0/clk]
connect_bd_net -net c_counter_binary_1_Q [get_bd_pins c0/Q] [get_bd_pins streamer_c0/s_axis_tdata]
connect_bd_net -net start_0_1 [get_bd_pins start] [get_bd_pins streamer_c0/start]
connect_bd_net -net count_0_1 [get_bd_pins count] [get_bd_pins streamer_c0/count]
connect_bd_net -net SINIT_5_1 [get_bd_pins SINIT] [get_bd_pins c0/SINIT]
connect_bd_net [get_bd_pins CE] [get_bd_pins c0/CE] [get_bd_pins streamer_c0/s_axis_tvalid]

current_bd_instance /channel_15
connect_bd_intf_net [get_bd_intf_pins m_axis] [get_bd_intf_pins streamer_c0/m_axis]
connect_bd_net [get_bd_pins clk] [get_bd_pins c0/CLK] [get_bd_pins streamer_c0/clk]
connect_bd_net -net c_counter_binary_1_Q [get_bd_pins c0/Q] [get_bd_pins streamer_c0/s_axis_tdata]
connect_bd_net -net start_0_1 [get_bd_pins start] [get_bd_pins streamer_c0/start]
connect_bd_net -net count_0_1 [get_bd_pins count] [get_bd_pins streamer_c0/count]
connect_bd_net -net SINIT_6_1 [get_bd_pins SINIT] [get_bd_pins c0/SINIT]
connect_bd_net [get_bd_pins CE] [get_bd_pins c0/CE] [get_bd_pins streamer_c0/s_axis_tvalid]

current_bd_instance /channel_4
connect_bd_intf_net [get_bd_intf_pins m_axis] [get_bd_intf_pins streamer_c0/m_axis]
connect_bd_net [get_bd_pins clk] [get_bd_pins c0/CLK] [get_bd_pins streamer_c0/clk]
connect_bd_net -net c_counter_binary_1_Q [get_bd_pins c0/Q] [get_bd_pins streamer_c0/s_axis_tdata]
connect_bd_net -net start_0_1 [get_bd_pins start] [get_bd_pins streamer_c0/start]
connect_bd_net -net count_0_1 [get_bd_pins count] [get_bd_pins streamer_c0/count]
connect_bd_net -net SINIT_1_1 [get_bd_pins SINIT] [get_bd_pins c0/SINIT]
connect_bd_net [get_bd_pins CE] [get_bd_pins c0/CE] [get_bd_pins streamer_c0/s_axis_tvalid]

current_bd_instance /
connect_bd_intf_net [get_bd_intf_pins channel_7/m_axis] [get_bd_intf_pins axis_combiner_0/S07_AXIS]
connect_bd_intf_net [get_bd_intf_pins mdm_1/MBDEBUG_0] [get_bd_intf_pins microblaze_0/DEBUG]
connect_bd_intf_net [get_bd_intf_pins channel_11/m_axis] [get_bd_intf_pins axis_combiner_0/S11_AXIS]
connect_bd_intf_net [get_bd_intf_pins channel_8/m_axis] [get_bd_intf_pins axis_combiner_0/S08_AXIS]
connect_bd_intf_net [get_bd_intf_pins axi_interconnect_0/S00_AXI] [get_bd_intf_pins axi_dma_16counters/M_AXI_S2MM]
connect_bd_intf_net -intf_net Vp_Vn_0_1 [get_bd_intf_ports Vp_Vn_0] [get_bd_intf_pins xadc_wiz_0/Vp_Vn]
connect_bd_intf_net [get_bd_intf_pins channel_14/m_axis] [get_bd_intf_pins axis_combiner_0/S14_AXIS]
connect_bd_intf_net [get_bd_intf_pins axi_traffic_gen_0/S_AXI] [get_bd_intf_pins axi_interconnect_1/M10_AXI]
connect_bd_intf_net -intf_net Vaux4_0_1 [get_bd_intf_ports Vaux4_0] [get_bd_intf_pins xadc_wiz_0/Vaux4]
connect_bd_intf_net [get_bd_intf_pins microblaze_0/M_AXI_IC] [get_bd_intf_pins axi_interconnect_0/S03_AXI]
connect_bd_intf_net [get_bd_intf_pins microblaze_0/M_AXI_DP] [get_bd_intf_pins axi_interconnect_1/S00_AXI]
connect_bd_intf_net [get_bd_intf_pins channel_3/m_axis] [get_bd_intf_pins axis_combiner_0/S03_AXIS]
connect_bd_intf_net [get_bd_intf_pins xadc_wiz_0/s_axi_lite] [get_bd_intf_pins axi_interconnect_1/M00_AXI]
connect_bd_intf_net [get_bd_intf_pins channel_2/m_axis] [get_bd_intf_pins axis_combiner_0/S02_AXIS]
connect_bd_intf_net -intf_net axi_gpio_0_GPIO2 [get_bd_intf_ports push_buttons_1bit] [get_bd_intf_pins led_but_gpio/GPIO2]
connect_bd_intf_net [get_bd_intf_pins axi_dma_16counters/S_AXI_LITE] [get_bd_intf_pins axi_interconnect_1/M01_AXI]
connect_bd_intf_net [get_bd_intf_ports cellular_ram] [get_bd_intf_pins axi_emc_0/EMC_INTF]
connect_bd_intf_net [get_bd_intf_pins axis_combiner_0/M_AXIS] [get_bd_intf_pins axi_dma_16counters/S_AXIS_S2MM]
connect_bd_intf_net [get_bd_intf_pins axis_combiner_0/M_AXIS] [get_bd_intf_pins ila_combiner/SLOT_0_AXIS]
connect_bd_intf_net [get_bd_intf_pins channel_6/m_axis] [get_bd_intf_pins axis_combiner_0/S06_AXIS]
connect_bd_intf_net [get_bd_intf_pins channel_10/m_axis] [get_bd_intf_pins axis_combiner_0/S10_AXIS]
connect_bd_intf_net [get_bd_intf_pins channel_15/m_axis] [get_bd_intf_pins axis_combiner_0/S15_AXIS]
connect_bd_intf_net [get_bd_intf_pins axi_interconnect_0/S02_AXI] [get_bd_intf_pins microblaze_0/M_AXI_DC]
connect_bd_intf_net [get_bd_intf_pins channel_5/m_axis] [get_bd_intf_pins axis_combiner_0/S05_AXIS]
connect_bd_intf_net [get_bd_intf_ports usb_uart] [get_bd_intf_pins axi_uartlite_0/UART]
connect_bd_intf_net [get_bd_intf_pins axi_timer_0/S_AXI] [get_bd_intf_pins axi_interconnect_1/M03_AXI]
connect_bd_intf_net [get_bd_intf_pins axi_iic/S_AXI] [get_bd_intf_pins axi_interconnect_1/M04_AXI]
connect_bd_intf_net [get_bd_intf_pins axi_interconnect_0/M00_AXI] [get_bd_intf_pins axi_emc_0/S_AXI_MEM]
connect_bd_intf_net -intf_net Vaux12_0_1 [get_bd_intf_ports Vaux12_0] [get_bd_intf_pins xadc_wiz_0/Vaux12]
connect_bd_intf_net [get_bd_intf_pins axi_intc_0/interrupt] [get_bd_intf_pins microblaze_0/INTERRUPT]
connect_bd_intf_net [get_bd_intf_pins channel_1/m_axis] [get_bd_intf_pins axis_combiner_0/S01_AXIS]
connect_bd_intf_net [get_bd_intf_pins channel_1/m_axis] [get_bd_intf_pins ila_ch0/SLOT_0_AXIS]
connect_bd_intf_net [get_bd_intf_pins channel_4/m_axis] [get_bd_intf_pins axis_combiner_0/S04_AXIS]
connect_bd_intf_net [get_bd_intf_pins axi_uartlite_0/S_AXI] [get_bd_intf_pins axi_interconnect_1/M06_AXI]
connect_bd_intf_net [get_bd_intf_pins axi_intc_0/s_axi] [get_bd_intf_pins axi_interconnect_1/M08_AXI]
connect_bd_intf_net [get_bd_intf_pins led_but_gpio/S_AXI] [get_bd_intf_pins axi_interconnect_1/M02_AXI]
connect_bd_intf_net [get_bd_intf_ports spi_bus] [get_bd_intf_pins axi_quad_spi_0/SPI_0]
connect_bd_intf_net -intf_net axi_gpio_0_GPIO [get_bd_intf_ports led_2bits] [get_bd_intf_pins led_but_gpio/GPIO]
connect_bd_intf_net [get_bd_intf_pins axi_quad_spi_0/AXI_LITE] [get_bd_intf_pins axi_interconnect_1/M05_AXI]
connect_bd_intf_net [get_bd_intf_pins axis_combiner_0/S09_AXIS] [get_bd_intf_pins axi_traffic_gen_0/M_AXIS_MASTER]
connect_bd_intf_net [get_bd_intf_pins axis_combiner_0/S09_AXIS] [get_bd_intf_pins ila_TF/SLOT_0_AXIS]
connect_bd_intf_net [get_bd_intf_pins channel_13/m_axis] [get_bd_intf_pins axis_combiner_0/S13_AXIS]
connect_bd_intf_net [get_bd_intf_pins channel_12/m_axis] [get_bd_intf_pins axis_combiner_0/S12_AXIS]
connect_bd_intf_net -intf_net axi_iic_0_IIC [get_bd_intf_ports iic_rtl] [get_bd_intf_pins axi_iic/IIC]
connect_bd_intf_net [get_bd_intf_pins axi_dma_0/S_AXI_LITE] [get_bd_intf_pins axi_interconnect_1/M09_AXI]
connect_bd_intf_net [get_bd_intf_pins axi_interconnect_0/S01_AXI] [get_bd_intf_pins axi_dma_0/M_AXI_S2MM]
connect_bd_intf_net [get_bd_intf_pins microblaze_0/DLMB] [get_bd_intf_pins microblaze_0_local_memory/DLMB]
connect_bd_intf_net [get_bd_intf_pins channel_0/m_axis] [get_bd_intf_pins axis_combiner_0/S00_AXIS]
connect_bd_intf_net [get_bd_intf_pins axi_gpio_0/S_AXI] [get_bd_intf_pins axi_interconnect_1/M07_AXI]
connect_bd_intf_net [get_bd_intf_pins xadc_wiz_0/M_AXIS] [get_bd_intf_pins ila_XADC/SLOT_0_AXIS]
connect_bd_intf_net [get_bd_intf_pins microblaze_0/ILMB] [get_bd_intf_pins microblaze_0_local_memory/ILMB]
connect_bd_intf_net [get_bd_intf_pins axis_data_fifo_0/M_AXIS] [get_bd_intf_pins axi_dma_0/S_AXIS_S2MM]
connect_bd_intf_net [get_bd_intf_pins gpio_1_cnt_axidata_fifo/S_AXI] [get_bd_intf_pins axi_interconnect_1/M11_AXI]
connect_bd_net -net axi_gpio_0_ip2intc_irpt [get_bd_pins led_but_gpio/ip2intc_irpt] [get_bd_pins interrupt_gatherer/In1]
connect_bd_net [get_bd_pins axi_timer_0/interrupt] [get_bd_pins interrupt_gatherer/In0]
connect_bd_net [get_bd_pins clk_wiz_0/locked] [get_bd_pins rst_clk_wiz_0_100M/dcm_locked]
connect_bd_net [get_bd_pins mdm_1/Debug_SYS_Rst] [get_bd_pins rst_clk_wiz_0_100M/mb_debug_sys_rst]
connect_bd_net -net microblaze_0_Clk [get_bd_pins clk_wiz_0/clk_out1] \
  [get_bd_pins microblaze_0_local_memory/LMB_Clk] [get_bd_pins axi_emc_0/s_axi_aclk] [get_bd_pins axi_emc_0/rdclk] \
  [get_bd_pins led_but_gpio/s_axi_aclk] [get_bd_pins axi_intc_0/s_axi_aclk] [get_bd_pins axi_timer_0/s_axi_aclk] \
  [get_bd_pins axi_uartlite_0/s_axi_aclk] [get_bd_pins microblaze_0/Clk] [get_bd_pins rst_clk_wiz_0_100M/slowest_sync_clk] \
  [get_bd_pins axi_iic/s_axi_aclk] [get_bd_pins axi_quad_spi_0/s_axi_aclk] [get_bd_pins axi_quad_spi_0/ext_spi_clk] \
  [get_bd_pins axi_dma_0/s_axi_lite_aclk] [get_bd_pins axi_dma_0/m_axi_s2mm_aclk] [get_bd_pins xadc_wiz_0/s_axi_aclk] \
  [get_bd_pins xadc_wiz_0/s_axis_aclk] [get_bd_pins axi_gpio_0/s_axi_aclk] [get_bd_pins axis_combiner_0/aclk] \
  [get_bd_pins channel_7/clk] [get_bd_pins channel_15/clk] [get_bd_pins channel_14/clk] [get_bd_pins channel_13/clk] \
  [get_bd_pins channel_12/clk] [get_bd_pins channel_11/clk] [get_bd_pins channel_10/clk] [get_bd_pins channel_8/clk] \
  [get_bd_pins channel_6/clk] [get_bd_pins channel_5/clk] [get_bd_pins channel_4/clk] [get_bd_pins channel_3/clk] \
  [get_bd_pins channel_2/clk] [get_bd_pins channel_1/clk] [get_bd_pins channel_0/CLK] \
  [get_bd_pins axi_dma_16counters/s_axi_lite_aclk] [get_bd_pins axi_dma_16counters/m_axi_s2mm_aclk] \
  [get_bd_pins ila_combiner/clk] [get_bd_pins ila_ch0/clk] [get_bd_pins axi_interconnect_0/ACLK] \
  [get_bd_pins axi_interconnect_0/S03_ACLK] [get_bd_pins axi_interconnect_0/S02_ACLK] \
  [get_bd_pins axi_interconnect_0/S01_ACLK] [get_bd_pins axi_interconnect_0/M00_ACLK] \
  [get_bd_pins axi_interconnect_0/S00_ACLK] [get_bd_pins axi_interconnect_1/ACLK] [get_bd_pins axi_interconnect_1/M09_ACLK] \
  [get_bd_pins axi_interconnect_1/M08_ACLK] [get_bd_pins axi_interconnect_1/M07_ACLK] \
  [get_bd_pins axi_interconnect_1/M06_ACLK] [get_bd_pins axi_interconnect_1/M05_ACLK] \
  [get_bd_pins axi_interconnect_1/M04_ACLK] [get_bd_pins axi_interconnect_1/M03_ACLK] \
  [get_bd_pins axi_interconnect_1/M02_ACLK] [get_bd_pins axi_interconnect_1/M01_ACLK] \
  [get_bd_pins axi_interconnect_1/M00_ACLK] [get_bd_pins axi_interconnect_1/S00_ACLK] \
  [get_bd_pins axi_traffic_gen_0/s_axi_aclk] [get_bd_pins ila_TF/clk] [get_bd_pins ila_XADC/clk] \
  [get_bd_pins axi_interconnect_1/M10_ACLK] [get_bd_pins axis_data_fifo_0/s_axis_aclk] \
  [get_bd_pins gpio_1_cnt_axidata_fifo/s_axi_aclk] [get_bd_pins axi_interconnect_1/M11_ACLK]
connect_bd_net [get_bd_ports reset] [get_bd_pins clk_wiz_0/reset] [get_bd_pins rst_clk_wiz_0_100M/ext_reset_in]
connect_bd_net [get_bd_pins rst_clk_wiz_0_100M/bus_struct_reset] [get_bd_pins microblaze_0_local_memory/SYS_Rst]
connect_bd_net [get_bd_pins rst_clk_wiz_0_100M/interconnect_aresetn] \
  [get_bd_pins axi_dma_0/axi_resetn] [get_bd_pins axi_dma_16counters/axi_resetn] [get_bd_pins axi_interconnect_0/S03_ARESETN] \
  [get_bd_pins axi_interconnect_0/S02_ARESETN] [get_bd_pins axi_interconnect_0/S01_ARESETN] \
  [get_bd_pins axi_interconnect_0/M00_ARESETN] [get_bd_pins axi_interconnect_0/S00_ARESETN] \
  [get_bd_pins axi_interconnect_0/ARESETN]
connect_bd_net [get_bd_pins rst_clk_wiz_0_100M/mb_reset] [get_bd_pins microblaze_0/Reset]
connect_bd_net [get_bd_pins rst_clk_wiz_0_100M/peripheral_aresetn] \
  [get_bd_pins axi_emc_0/s_axi_aresetn] [get_bd_pins led_but_gpio/s_axi_aresetn] [get_bd_pins axi_intc_0/s_axi_aresetn] \
  [get_bd_pins axi_timer_0/s_axi_aresetn] [get_bd_pins axi_uartlite_0/s_axi_aresetn] [get_bd_pins axi_iic/s_axi_aresetn] \
  [get_bd_pins axi_quad_spi_0/s_axi_aresetn] [get_bd_pins xadc_wiz_0/s_axi_aresetn] [get_bd_pins axi_gpio_0/s_axi_aresetn] \
  [get_bd_pins axis_combiner_0/aresetn] [get_bd_pins axi_interconnect_1/M09_ARESETN] \
  [get_bd_pins axi_interconnect_1/M08_ARESETN] [get_bd_pins axi_interconnect_1/M07_ARESETN] \
  [get_bd_pins axi_interconnect_1/M06_ARESETN] [get_bd_pins axi_interconnect_1/M05_ARESETN] \
  [get_bd_pins axi_interconnect_1/M04_ARESETN] [get_bd_pins axi_interconnect_1/M03_ARESETN] \
  [get_bd_pins axi_interconnect_1/M02_ARESETN] [get_bd_pins axi_interconnect_1/M01_ARESETN] \
  [get_bd_pins axi_interconnect_1/M00_ARESETN] [get_bd_pins axi_interconnect_1/S00_ARESETN] \
  [get_bd_pins axi_interconnect_1/ARESETN] [get_bd_pins axi_traffic_gen_0/s_axi_aresetn] \
  [get_bd_pins axi_interconnect_1/M10_ARESETN] [get_bd_pins axis_data_fifo_0/s_axis_aresetn] \
  [get_bd_pins gpio_1_cnt_axidata_fifo/s_axi_aresetn] [get_bd_pins axi_interconnect_1/M11_ARESETN]
connect_bd_net [get_bd_ports sys_clock] [get_bd_pins clk_wiz_0/clk_in1]
connect_bd_net [get_bd_pins axi_uartlite_0/interrupt] [get_bd_pins interrupt_gatherer/In2]
connect_bd_net -net xlconcat_0_dout [get_bd_pins interrupt_gatherer/dout] [get_bd_pins axi_intc_0/intr]
connect_bd_net -net axi_iic_0_iic2intc_irpt [get_bd_pins axi_iic/iic2intc_irpt] [get_bd_pins interrupt_gatherer/In3]
connect_bd_net [get_bd_pins axi_timer_0/generateout0] [get_bd_ports generateout0_0]
connect_bd_net -net capturetrig0_0_1 [get_bd_ports capturetrig0_0] [get_bd_pins axi_timer_0/capturetrig0]
connect_bd_net -net capturetrig1_0_1 [get_bd_ports capturetrig1_0] [get_bd_pins axi_timer_0/capturetrig1]
connect_bd_net -net freeze_0_1 [get_bd_ports freeze_0] [get_bd_pins axi_timer_0/freeze]
connect_bd_net [get_bd_pins axi_timer_0/generateout1] [get_bd_ports generateout1_0]
connect_bd_net [get_bd_pins axi_timer_0/pwm0] [get_bd_ports pwm0_0]
connect_bd_net [get_bd_pins axi_gpio_0/gpio_io_o] \
  [get_bd_pins start_sig_25/Din] [get_bd_pins max_size_packet_24_to_0/Din] [get_bd_pins init_counters_27/Din] \
  [get_bd_pins enable_counters_26/Din] [get_bd_pins start_TF_28/Din] [get_bd_pins stop_TF_29/Din]
connect_bd_net -net xlslice_0_Dout [get_bd_pins max_size_packet_24_to_0/Dout] \
  [get_bd_pins channel_0/count] [get_bd_pins channel_1/count] [get_bd_pins channel_2/count] [get_bd_pins channel_3/count] \
  [get_bd_pins channel_4/count] [get_bd_pins channel_5/count] [get_bd_pins channel_6/count] [get_bd_pins channel_7/count] \
  [get_bd_pins channel_8/count] [get_bd_pins channel_10/count] [get_bd_pins channel_11/count] [get_bd_pins channel_12/count] \
  [get_bd_pins channel_13/count] [get_bd_pins channel_14/count] [get_bd_pins channel_15/count]
connect_bd_net -net xlslice_1_Dout [get_bd_pins start_sig_25/Dout] \
  [get_bd_pins channel_4/start] [get_bd_pins channel_5/start] [get_bd_pins channel_6/start] [get_bd_pins channel_7/start] \
  [get_bd_pins channel_8/start] [get_bd_pins channel_10/start] [get_bd_pins channel_11/start] [get_bd_pins channel_12/start] \
  [get_bd_pins channel_13/start] [get_bd_pins channel_14/start] [get_bd_pins channel_15/start] [get_bd_pins channel_3/start] \
  [get_bd_pins channel_2/start] [get_bd_pins channel_1/start] [get_bd_pins channel_0/start]
connect_bd_net -net xlslice_2_Dout [get_bd_pins init_counters_27/Dout] \
  [get_bd_pins channel_15/SINIT] [get_bd_pins channel_14/SINIT] [get_bd_pins channel_13/SINIT] [get_bd_pins channel_12/SINIT] \
  [get_bd_pins channel_11/SINIT] [get_bd_pins channel_10/SINIT] [get_bd_pins channel_8/SINIT] [get_bd_pins channel_7/SINIT] \
  [get_bd_pins channel_6/SINIT] [get_bd_pins channel_5/SINIT] [get_bd_pins channel_4/SINIT] [get_bd_pins channel_3/SINIT] \
  [get_bd_pins channel_2/SINIT] [get_bd_pins channel_1/SINIT] [get_bd_pins channel_0/SINIT]
connect_bd_net [get_bd_pins axi_quad_spi_0/ip2intc_irpt] [get_bd_pins interrupt_gatherer/In4]
connect_bd_net -net CE_1 [get_bd_pins enable_counters_26/Dout] \
  [get_bd_pins channel_1/CE] [get_bd_pins channel_8/CE] [get_bd_pins channel_15/CE] [get_bd_pins channel_14/CE] \
  [get_bd_pins channel_13/CE] [get_bd_pins channel_12/CE] [get_bd_pins channel_11/CE] [get_bd_pins channel_10/CE] \
  [get_bd_pins channel_7/CE] [get_bd_pins channel_6/CE] [get_bd_pins channel_5/CE] [get_bd_pins channel_4/CE] \
  [get_bd_pins channel_3/CE] [get_bd_pins channel_0/CE] [get_bd_pins channel_2/CE]
connect_bd_net [get_bd_pins stop_TF_29/Dout] [get_bd_pins axi_traffic_gen_0/core_ext_stop]
connect_bd_net [get_bd_pins start_TF_28/Dout] [get_bd_pins axi_traffic_gen_0/core_ext_start]
connect_bd_net [get_bd_pins xadc_wiz_0/m_axis_tvalid] [get_bd_pins axis_data_fifo_0/s_axis_tvalid]
connect_bd_net [get_bd_pins axis_data_fifo_0/s_axis_tready] [get_bd_pins xadc_wiz_0/m_axis_tready]
connect_bd_net [get_bd_pins axis_data_fifo_0/axis_rd_data_count] [get_bd_pins gpio_1_cnt_axidata_fifo/gpio_io_i]
connect_bd_net [get_bd_pins xadc_wiz_0/m_axis_tdata] [get_bd_pins axis_data_fifo_0/s_axis_tdata]
set_property HDL_ATTRIBUTE.BMM_INFO_PROCESSOR {microblaze-le > user_35t microblaze_0_local_memory/dlmb_bram_if_cntlr} [get_bd_cells microblaze_0]
set_property HDL_ATTRIBUTE.KEEP_HIERARCHY yes [get_bd_cells microblaze_0]

# ---- address map ----
assign_bd_address -offset 0x60000000 -range 512K -target_address_space [get_bd_addr_spaces axi_dma_0/Data_S2MM] [get_bd_addr_segs axi_emc_0/S_AXI_MEM/Mem0]
assign_bd_address -offset 0x60000000 -range 512K -target_address_space [get_bd_addr_spaces axi_dma_16counters/Data_S2MM] [get_bd_addr_segs axi_emc_0/S_AXI_MEM/Mem0]
assign_bd_address -offset 0x00000000 -range 32K -target_address_space [get_bd_addr_spaces microblaze_0/Data] [get_bd_addr_segs microblaze_0_local_memory/dlmb_bram_if_cntlr/SLMB/Mem]
assign_bd_address -offset 0x40000000 -range 64K -target_address_space [get_bd_addr_spaces microblaze_0/Data] [get_bd_addr_segs led_but_gpio/S_AXI/Reg]
assign_bd_address -offset 0x40010000 -range 64K -target_address_space [get_bd_addr_spaces microblaze_0/Data] [get_bd_addr_segs axi_gpio_0/S_AXI/Reg]
assign_bd_address -offset 0x40020000 -range 64K -target_address_space [get_bd_addr_spaces microblaze_0/Data] [get_bd_addr_segs gpio_1_cnt_axidata_fifo/S_AXI/Reg]
assign_bd_address -offset 0x40600000 -range 64K -target_address_space [get_bd_addr_spaces microblaze_0/Data] [get_bd_addr_segs axi_uartlite_0/S_AXI/Reg]
assign_bd_address -offset 0x40800000 -range 64K -target_address_space [get_bd_addr_spaces microblaze_0/Data] [get_bd_addr_segs axi_iic/S_AXI/Reg]
assign_bd_address -offset 0x41200000 -range 64K -target_address_space [get_bd_addr_spaces microblaze_0/Data] [get_bd_addr_segs axi_intc_0/S_AXI/Reg]
assign_bd_address -offset 0x41C00000 -range 64K -target_address_space [get_bd_addr_spaces microblaze_0/Data] [get_bd_addr_segs axi_timer_0/S_AXI/Reg]
assign_bd_address -offset 0x41E00000 -range 64K -target_address_space [get_bd_addr_spaces microblaze_0/Data] [get_bd_addr_segs axi_dma_0/S_AXI_LITE/Reg]
assign_bd_address -offset 0x41E10000 -range 64K -target_address_space [get_bd_addr_spaces microblaze_0/Data] [get_bd_addr_segs axi_dma_16counters/S_AXI_LITE/Reg]
assign_bd_address -offset 0x44A00000 -range 64K -target_address_space [get_bd_addr_spaces microblaze_0/Data] [get_bd_addr_segs xadc_wiz_0/s_axi_lite/Reg]
assign_bd_address -offset 0x44A10000 -range 64K -target_address_space [get_bd_addr_spaces microblaze_0/Data] [get_bd_addr_segs axi_quad_spi_0/AXI_LITE/Reg]
assign_bd_address -offset 0x44A20000 -range 64K -target_address_space [get_bd_addr_spaces microblaze_0/Data] [get_bd_addr_segs axi_traffic_gen_0/S_AXI/Reg0]
assign_bd_address -offset 0x60000000 -range 512K -target_address_space [get_bd_addr_spaces microblaze_0/Data] [get_bd_addr_segs axi_emc_0/S_AXI_MEM/Mem0]
assign_bd_address -offset 0x00000000 -range 32K -target_address_space [get_bd_addr_spaces microblaze_0/Instruction] [get_bd_addr_segs microblaze_0_local_memory/ilmb_bram_if_cntlr/SLMB/Mem]
assign_bd_address -offset 0x60000000 -range 512K -target_address_space [get_bd_addr_spaces microblaze_0/Instruction] [get_bd_addr_segs axi_emc_0/S_AXI_MEM/Mem0]

validate_bd_design
save_bd_design
